# Altium schematic sheet MSP_Power_Program.SchDoc
size A4; Organization: Creotech Instruments; Address1: Gen. L. Okulickiego 7/9; Address2: 05-500 Piaseczno; Address3: Poland
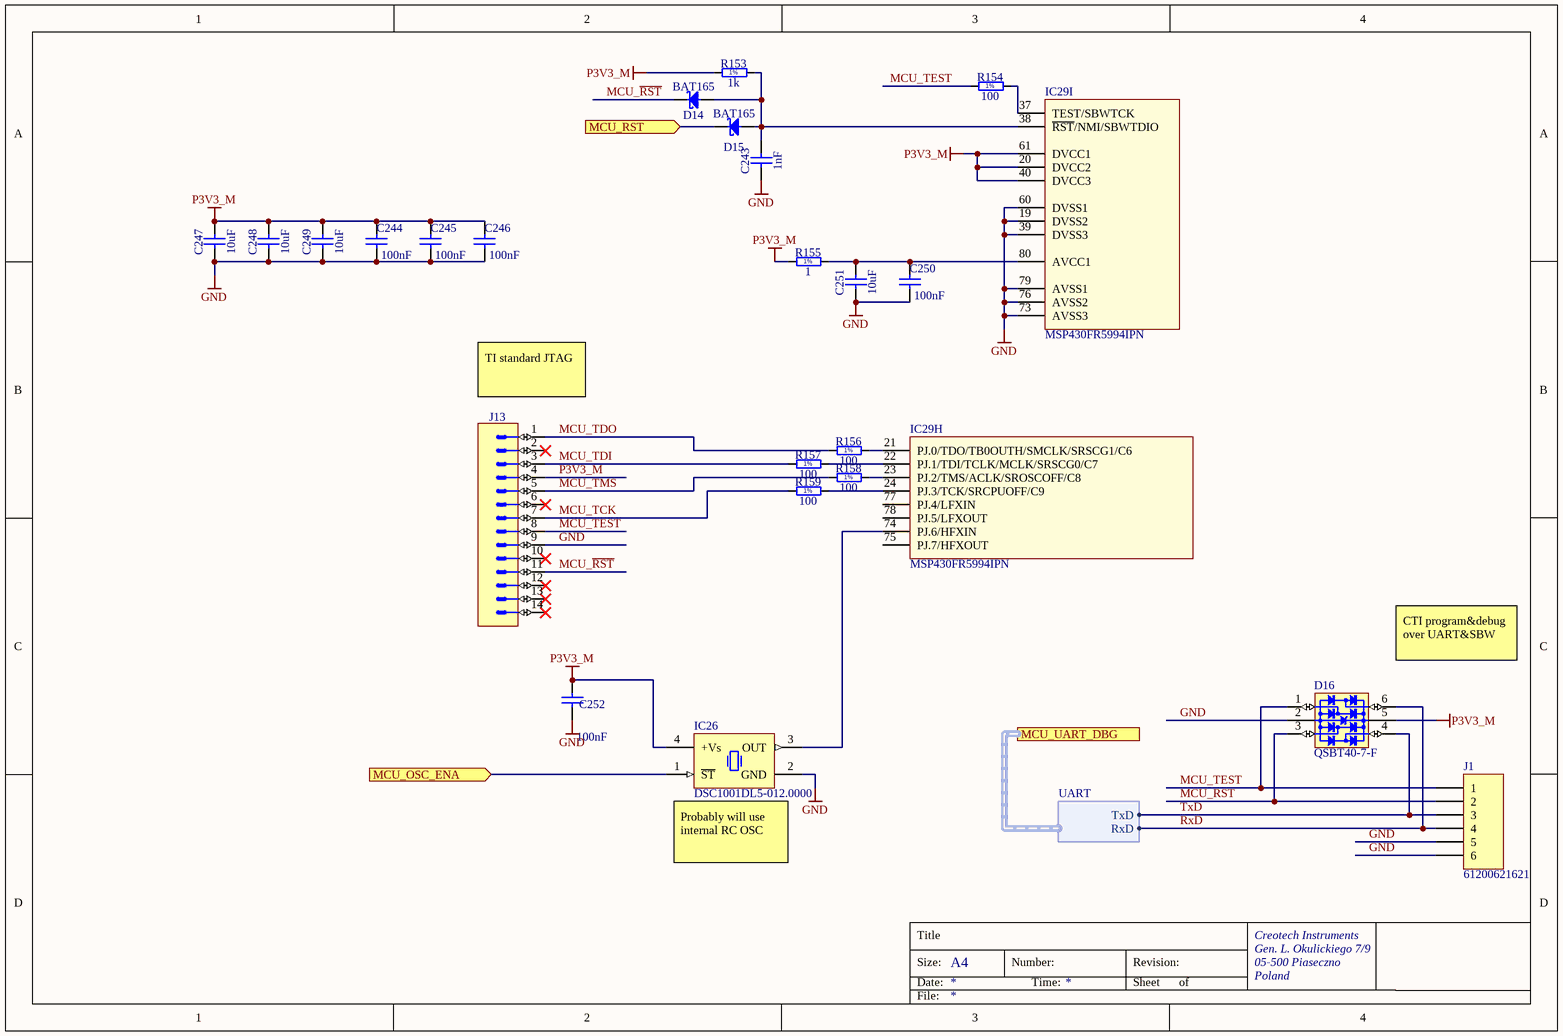
[diagram p0: MSP_Power_Program.SchDoc]

## Parts
C243  1nF  [CAPC1608X87N]
C244  100nF  [CAPC1608X87N]
C245  100nF  [CAPC1608X87N]
C246  100nF  [CAPC1608X87N]
C247  10uF  [CAPC1608X80N]
C248  10uF  [CAPC1608X80N]
C249  10uF  [CAPC1608X80N]
C250  100nF  [CAPC1608X87N]
C251  10uF  [CAPC1608X80N]
C252  100nF  [CAPC1608X87N]
D14  BAT165  [SOD2512X110N]
D15  BAT165  [SOD2512X110N]
D16  QSBT40-7-F  [SOT65P210X110-6N]
IC26  DSC1001DL5-012.0000  [OSC_MICREL_2520]
IC29  MSP430FR5994IPN  [PQFP50P1400X1400-80N]  (parts H,I of 9)
J1  61200621621  [61200621621]
J13  Header 14  [3M_N2514-6002RB]  (value not drawn)
R153  1k  [RESC1608X55N]
R154  100  [RESC1608X55N]
R155  1  [RESC1608X55N]
R156  100  [RESC1608X55N]
R157  100  [RESC1608X55N]
R158  100  [RESC1608X55N]
R159  100  [RESC1608X55N]

## Ports
MCU_OSC_ENA (in), MCU_RST (in), MCU_UART_DBG (harness UART)

## Harnesses
UART: TxD, RxD

## Nets
GND: C243.1 C244.1 C245.1 C246.1 C247.1 C248.1 C249.1 C250.1 C251.1 C252.1 D16.2(GND) IC26.2(GND) IC29.19(DVSS2) IC29.39(DVSS3) IC29.60(DVSS1) IC29.73(AVSS3) IC29.76(AVSS2) IC29.79(AVSS1) J1.5 J1.6 J13.9
P3V3_M: C244.2 C245.2 C246.2 C247.2 C248.2 C249.2 C252.2 D16.5(VBUS) IC26.4(+Vs) IC29.20(DVCC2) IC29.40(DVCC3) IC29.61(DVCC1) J13.4 R153.1 R155.1
MCU_OSC_ENA: IC26.1(~{ST}) ; port MCU_OSC_ENA
MCU_~{RST}: D14.1(C) D16.3(I/O2) J1.2 J13.11
MCU_RST: D15.1(C) ; port MCU_RST
MCU_TCK: J13.7 R159.1
MCU_TDI: J13.3 R157.1
MCU_TDO: J13.1 R156.1
MCU_TEST: D16.1(I/O1) J1.1 J13.8 R154.1
MCU_TMS: J13.5 R158.1
RxD: D16.6(I/O4) J1.4 ; port MCU_UART_DBG.RxD
TxD: D16.4(I/O3) J1.3 ; port MCU_UART_DBG.TxD
NetC243_2: C243.2 D14.2(A) D15.2(A) IC29.38(~{RST}/NMI/SBWTDIO) R153.2
NetC250_2: C250.2 C251.2 IC29.80(AVCC1) R155.2
NetIC26_3: IC26.3(OUT) IC29.74(PJ.6/HFXIN)
NetIC29_21: IC29.21(PJ.0/TDO/TB0OUTH/SMCLK/SRSCG1/C6) R156.2
NetIC29_22: IC29.22(PJ.1/TDI/TCLK/MCLK/SRSCG0/C7) R157.2
NetIC29_23: IC29.23(PJ.2/TMS/ACLK/SROSCOFF/C8) R158.2
NetIC29_24: IC29.24(PJ.3/TCK/SRCPUOFF/C9) R159.2
NetIC29_37: IC29.37(TEST/SBWTCK) R154.2

Not connected (* = marked no-connect by the designer): IC29 75(PJ.7/HFXOUT) 77(PJ.4/LFXIN) 78(PJ.5/LFXOUT); J13 2* 6* 10* 12* 13* 14*

## Notes on the sheet
- (near J13) TI standard JTAG
- CTI program&debug over UART&SBW
- (near IC26) Probably will use internal RC OSC
- Title
- Size:
- Date:
- A4
- Number:
- Time:
- Revision:
- Sheet
- of
- File:
- (in symbol R0603_1K_1%_0.1W_100PPM) 1%
- (in symbol R0603_1R_1%_0.1W_200PPM) 1%
- (in symbol R0603_100R_1%_0.1W_100PPM) 1%

## Library data of the parts
C243 = CC0603_1NF_50V_10%_X7R: Non-polarised capacitor; Part Description: SMD Multilayer Chip Ceramic Capacitor; Manufacturer: GENERIC; Manufacturer1 Part Number: 223858615623; Voltage: 50V; TC: X7R; Tolerance: ±10%; Part Number: CC0603_1NF_50V_10%_X7R; Component Kind: Standard; Component Type: Standard; Pin Count: 2; Value: 1nF; Status: Preferred; Manufacturer Part Number: CC0603_1NF_50V_10%_X7R; Case: 0603; Mounted: Yes; Socket: No; SMD: Yes; Sense: No; Manufacturer1 Example: PHYCOMP; Manufacturer1 ComponentHeight: 0.87mm; HelpURL: \\cern.ch\dfs\Applications\Altium\Datasheets\CC0603_X7R_PHYCOMP.pdf; Author: CERN DEM JLC; CreateDate: 03.12.2007; LatestRevisionDate: 03.12.2007
C244-C246 C250 C252 = CC0603_100NF_50V_10%_X7R: Non-polarised capacitor; Part Description: SMD Multilayer Chip Ceramic Capacitor; Manufacturer: GENERIC; Manufacturer1 Part Number: 223858615649; Voltage: 50V; TC: X7R; Tolerance: ±10%; Part Number: CC0603_100NF_50V_10%_X7R; Component Kind: Standard; Component Type: Standard; Pin Count: 2; Value: 100nF; Status: Preferred; Manufacturer Part Number: CC0603_100NF_50V_10%_X7R; Case: 0603; Mounted: Yes; Socket: No; SMD: Yes; Sense: No; Manufacturer1 Example: PHYCOMP; Manufacturer1 ComponentHeight: 0.87mm; HelpURL: \\cern.ch\dfs\Applications\Altium\Datasheets\CC0603_X7R_PHYCOMP.pdf; Author: CERN DEM JLC; CreateDate: 2007-12-03; LatestRevisionDate: 2007-12-03
C247-C249 C251 = CC0603_10UF_16V_20%_X5R: Non-polarised capacitor; Part Description: SMD Multilayer Chip Ceramic Capacitor; Manufacturer: GENERIC; Manufacturer1 Part Number: GRM188R61C106MA73D; Voltage: 16V; TC: X5R; Tolerance: ±20%; Part Number: CC0603_10UF_16V_20%_X5R; Component Kind: Standard; Component Type: Standard; Pin Count: 2; Value: 10uF; Status: None; Manufacturer Part Number: CC0603_10UF_16V_20%_X5R; Case: 0603; Mounted: Yes; Socket: No; SMD: Yes; Sense: No; Manufacturer1 Example: MURATA; Manufacturer1 ComponentHeight: 0.8mm; HelpURL: \\cern.ch\dfs\Applications\Altium\Datasheets\CC0603_X5R_MURATA_GRM.pdf; Author: CERN DEM MR
  C247-C249: CreateDate: 02.03.2016; LatestRevisionDate: 02.03.2016
  C251: CreateDate: 2016-03-02; LatestRevisionDate: 2016-03-02
D14 D15 = BAT165: Schottky Diode; Part Description: Medium Power AF Schottky Diode; Manufacturer: INFINEON; Voltage: 40V; Power: 750mA; PressFit: No; Bonding: No; Part Number: BAT165; Component Kind: Standard; Component Type: Standard; Device: BAT165; PackageDescription: Small Outline Diode (SOD-323), 1.70mm W X 1.25mm L X 1.10mm H body,  IPC Medium Density; Manufacturer Part Number: BAT165; Pin Count: 2; Case: SOD323; Mounted: Yes; Socket: No; SMD: Yes; Sense: No; ComponentHeight: 1.1mm; HelpURL: \\cern.ch\dfs\Applications\Altium\Datasheets\BAT165.pdf; Author: CERN DEM JLC; CreateDate: 12.11.2014; LatestRevisionDate: 12.11.2014
D16 = D_TVS_QSBT40-7-F: Bonding: No; PressFit: No; Case: *; Component Kind: Standard; Component Type: Standard; ComponentHeigth: *; CreateDate: 2018-01-01; Device: QSBT40-7-F; Footprint: SOT363; HelpURL: *; LatestRevisionDate: 2018-01-01; Manufacturer: *; Manufacturer Part Number: QSBT40-7-F; Mounted: Yes; PackageDescription: *; Part Description: *; Part Number: *; Pin Count: 6; Sense: No; SMD: Yes; Socket: No; Value: *
IC26 = OSC_DSC1001DL5-012.0000: MEMS Oscillator 12MHz; Manufacturer: Micrel; Bonding: No; PressFit: No; Case: *; Component Kind: Standard; Component Type: Standard; ComponentHeigth: *; CreateDate: 2018-05-21; Device: DSC1001DL5-012.0000; Footprint: MICREL SMD Oscillator, QFN, 4 pins, 2.5mm x 2.0mm; HelpURL: *; LatestRevisionDate: 2018-05-21; Manufacturer Part Number: DSC1001DL5-012.0000; Mounted: Yes; PackageDescription: MICREL SMD Oscillator, QFN, 4 pins, 2.5mm x 2.0mm; Part Description: MEMS Oscillator 12MHz; Part Number: DSC1001DL5-012.0000; Pin Count: 4; Sense: No; SMD: Yes; Socket: No; Value: *
IC29 = UPC_MSP430FR5994IPN: Manufacturer: TI; Part Description: FRAM microcontroller; Bonding: No; ComponentHeigth: 2mm; PressFit: No; Case: LQFP80; Component Kind: Standard; Component Type: Standard; CreateDate: 2018-01-01; Device: MSP430FR5994IPN; Footprint: LQFP80; HelpURL: *; LatestRevisionDate: 2018-01-01; Manufacturer Part Number: MSP430FR5994IPN; Mounted: Yes; PackageDescription: LQFP80; Part Number: MSP430FR5994IPN; Pin Count: 80; Sense: No; SMD: Yes; Socket: No; Value: *
J1 = CON_IDC_6_61200621621: 6 pin male socket 2.54 IDC; Bonding: No; PressFit: No; Case: *; Component Kind: Standard; Component Type: Standard; ComponentHeigth: *; CreateDate: 2018-01-01; Device: 61200621621; HelpURL: *; LatestRevisionDate: 2018-01-01; Manufacturer: *; Manufacturer Part Number: 61200621621; Mounted: Yes; PackageDescription: *; Part Description: IDC; Part Number: 61200621621; Pin Count: 6; Sense: No; SMD: Yes; Socket: No; Value: 61200621621
J13 = 3M_N2514-6002RB: Connector 14 Male; Part Description: 14 Contacts - Straight .100'' x .100'' Low Profile Four-Wall Header, 2500 Series; Manufacturer: 3M; PressFit: No; Part Number: 3M_N2514-6002RB; Component Kind: Standard; Component Type: Standard; Pin Count: 14; Family: Header 14; Mounted: Yes; Socket: No; SMD: No; Sense: No; Status: None; Manufacturer Part Number: N2514-6002RB; ComponentHeight: 10.03mm; HelpURL: \\cern.ch\dfs\Applications\Altium\Datasheets\3M_N2514-6002RB.pdf; Author: CERN DEM JLC; CreateDate: 2009-02-11; LatestRevisionDate: 2009-08-11
R153 = R0603_1K_1%_0.1W_100PPM: Resistor - 1%; Part Description: General Purpose Thick Film Chip Resistor; Manufacturer: GENERIC; Manufacturer1 Part Number: NRC06F1001TRF; Power: 0.1W; TC: ±100ppm/°C; PressFit: No; Part Number: R0603_1K_1%_0.1W_100PPM; Component Kind: Standard; Component Type: Standard; Pin Count: 2; Value: 1k; Status: Preferred; Tolerance: ±1%; Manufacturer Part Number: R0603_1K_1%_0.1W_100PPM; Case: 0603; Mounted: Yes; Sense: No; Socket: No; SMD: Yes; Manufacturer1 Example: NIC COMPONENT; Manufacturer1 ComponentHeight: 0.55mm; HelpURL: \\cern.ch\dfs\Applications\Altium\Datasheets\R0603_NIC_NRC.pdf; Author: CERN DEM JLC; CreateDate: 03.12.2007; LatestRevisionDate: 13.03.2008
R154 R156-R159 = R0603_100R_1%_0.1W_100PPM: Resistor - 1%; Part Description: General Purpose Thick Film Chip Resistor; Manufacturer: GENERIC; Manufacturer1 Part Number: NRC06F4700TRF; Power: 0.1W; TC: ±100ppm/°C; PressFit: No; Part Number: R0603_100R_1%_0.1W_100PPM; Component Kind: Standard; Component Type: Standard; Pin Count: 2; Value: 100; Status: Preferred; Tolerance: ±1%; Manufacturer Part Number: R0603_100R_1%_0.1W_100PPM; Case: 0603; Mounted: Yes; Sense: No; Socket: No; SMD: Yes; Manufacturer1 Example: NIC COMPONENT; Manufacturer1 ComponentHeight: 0.55mm; HelpURL: \\cern.ch\dfs\Applications\Altium\Datasheets\R0603_NIC_NRC.pdf; Author: CERN DEM JLC; CreateDate: 2007-12-03; LatestRevisionDate: 2008-03-13
R155 = R0603_1R_1%_0.1W_200PPM: Resistor - 1%; Part Description: General Purpose Thick Film Chip Resistor; Manufacturer: GENERIC; Manufacturer1 Part Number: 232270461008L or RC0603FR-071RL; Power: 0.1W; TC: ±200ppm/°C; PressFit: No; Part Number: R0603_1R_1%_0.1W_200PPM; Component Kind: Standard; Component Type: Standard; Pin Count: 2; Value: 1; Status: Preferred; Tolerance: ±1%; Manufacturer Part Number: R0603_1R_1%_0.1W_200PPM; Case: 0603; Mounted: Yes; Sense: No; Socket: No; SMD: Yes; Manufacturer1 Example: YAGEO PHYCOMP; Manufacturer1 ComponentHeight: 0.65mm; HelpURL: \\cern.ch\dfs\Applications\Altium\Datasheets\R0603_Phycomp_RC0603.pdf; Author: CERN DEM JLC; CreateDate: 2007-12-03; LatestRevisionDate: 2012-10-17